# EasyEDA schematic SCH_teency_2021-08-24.json
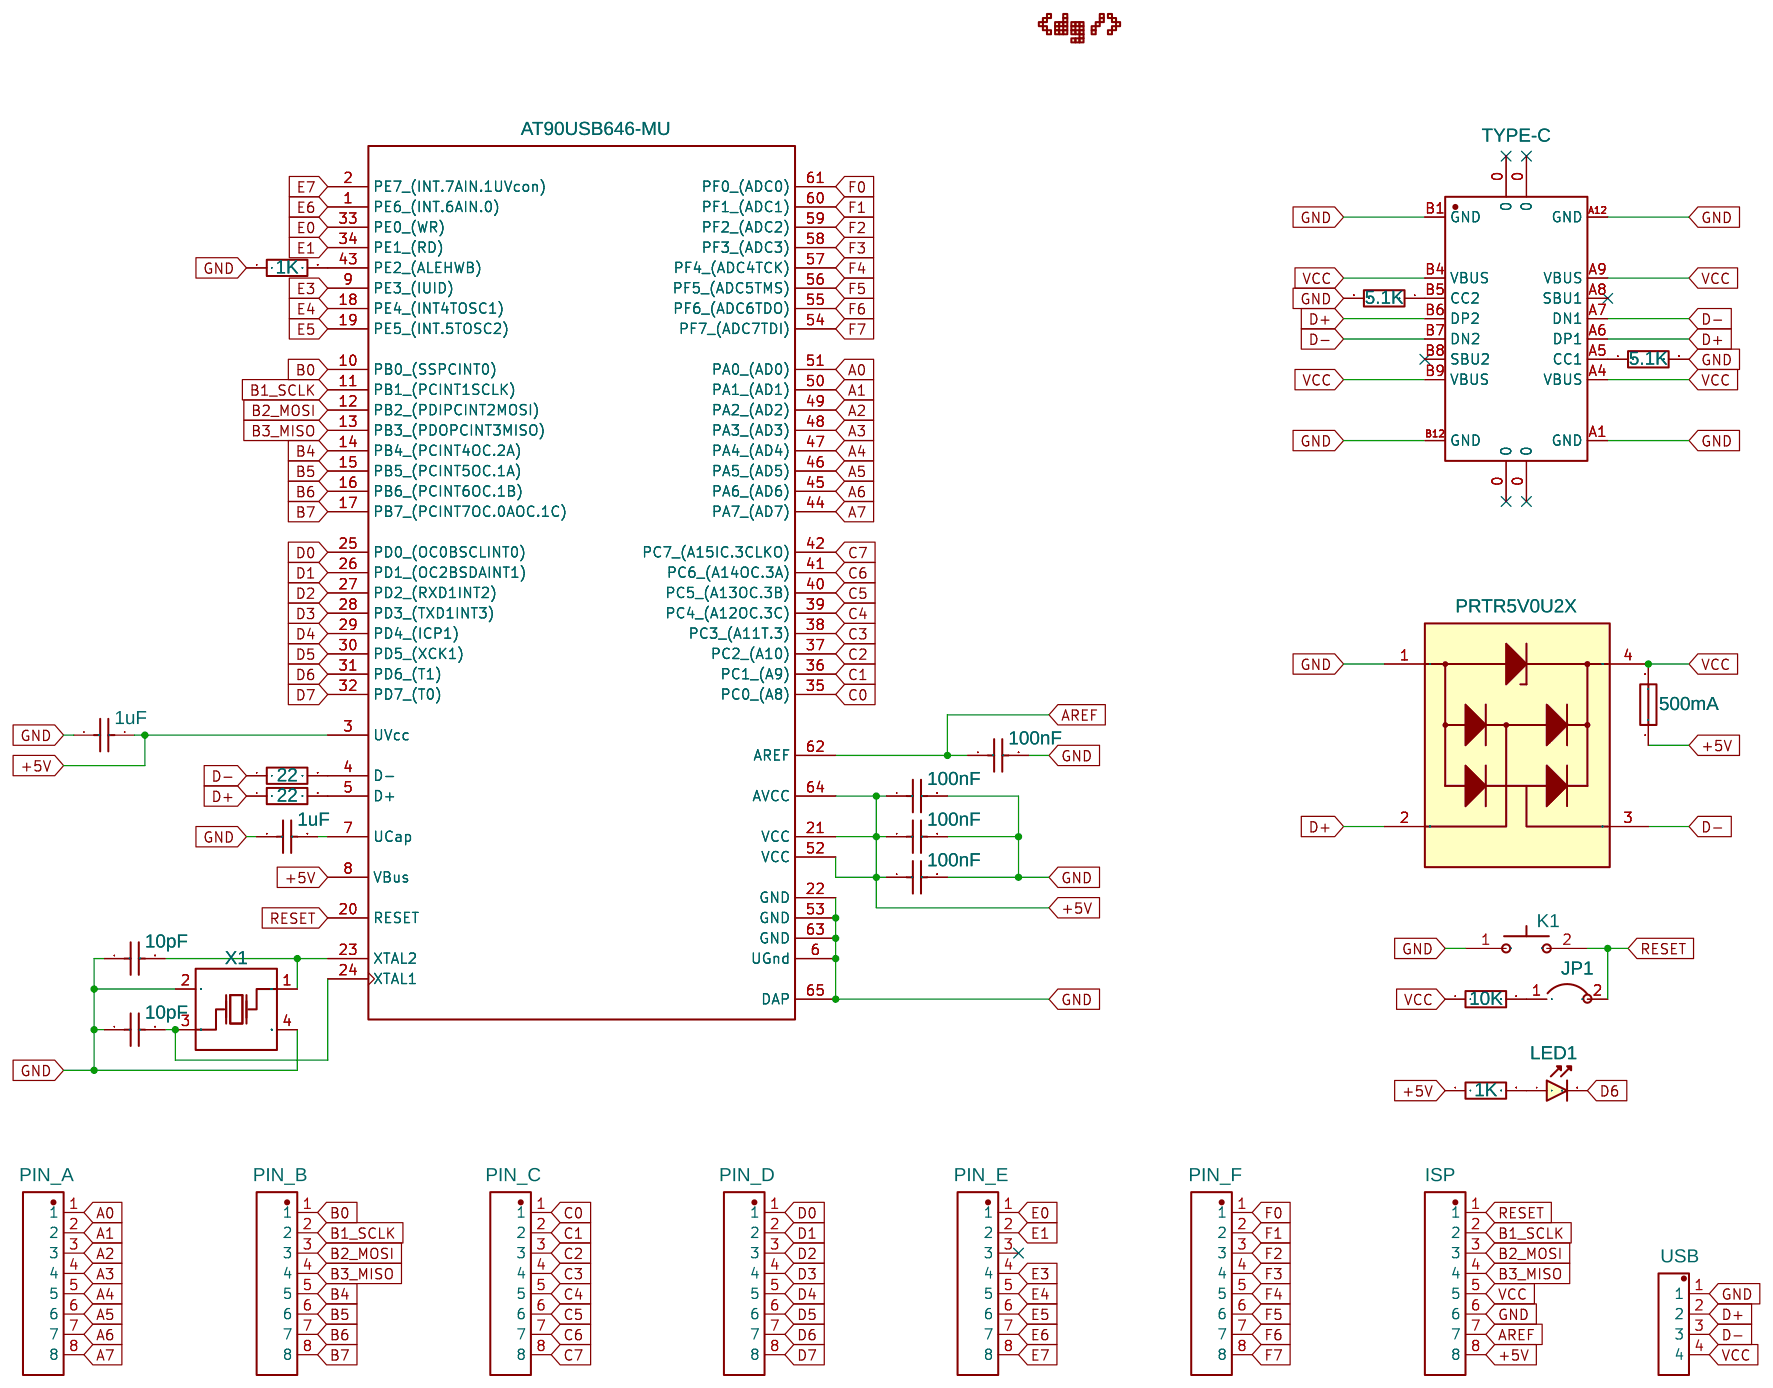
[diagram p0: schematic sheet]

## Parts
C1  1uF  [C0805]
C2  100nF  [C0805]
C3  100nF  [C0805]
C4  1uF  [C0805]
C5  100nF  [C0805]
C6  100nF  [C0805]
C7  10pF  [0805]
C8  10pF  [0805]
CN1  TYPE-C  [USB-C_SMD-TYPE-C-31-M-12]
F1  500mA  [F1206]
JP1  JUMPER  [JUMPER]
K1  3x6x2.5 Switch  [KEY-SMD_L6.1-W3.7-LS8.0]
L1  Logo  [LOGO_XL]
LED1  0603 LED  [0603 LED 0.8]
P1  PIN_A  [2.54 8P]
P2  PIN_B  [2.54 8P]
P3  PIN_C  [2.54 8P]
P4  PIN_D  [2.54 8P]
P5  PIN_E  [2.54 8P]
P6  PIN_F  [2.54 8P]
P7  ISP  [2.54 8P]
P8  USB  [LEE_2.54排针-P2.54-4P]
R1  1K  [R0805]
R2  5.1K  [R0805]
R3  5.1K  [R0805]
R4  22  [R0805]
R5  22  [R0805]
R6  10K  [R0805]
R7  1K  [R0805]
U1  AT90USB646-MU  [64PS]
U2  PRTR5V0U2X  [SOT-143_L2.9-W1.3-P1.92-LS2.3-BL]
X1  16MHz  [OSC-SMD_4P-L5.0-W3.2-BL]

## Library data of the parts
C1 C4 = CL21B105KBFNNNE: Supplier: LCSC; Manufacturer: SAMSUNG; LCSC Assembly: Yes; Supplier Part: C28323; SMT Type: Basic
C2 C3 C5 C6 = CC0805KRX7R9BB104: Supplier: LCSC; Manufacturer Part: CL21B104KBCNNNC; Manufacturer: SAMSUNG; LCSC Assembly: Yes; Supplier Part: C1711; SMT Type: Basic
C7 C8 = 贴片电容-0805-10pF: Supplier: LCSC; Manufacturer Part: CL21C100JBANNNC; Manufacturer: SAMSUNG; LCSC Assembly: Yes; Supplier Part: C1785; SMT Type: Basic
CN1 = TYPE-C-31-M-12: Supplier: LCSC; Supplier Part: C165948; Manufacturer: Rectangular Connectors - Contacts; Contributor: LCSC
F1 = MF-NSMF050-2: Supplier: LCSC; Manufacturer: BOURNS; Supplier Part: C75464; LCSC Assembly: Yes; SMT Type: Extend
JP1 = JUMPER: Contributor: dxgdsx
K1 = 1TS002E-2400-2500: Supplier: LCSC; Supplier Part: C319365; Manufacturer: HYP; Contributor: LCSC
L1 = Logo: Contributor: myst729
LED1 = 0603 LED: Contributor: Gerwin
P1-P7 = 2.54 8P: Contributor: danke16
P8 = Lee_2.54排针-P2.54-4P: Supplier: LCSC; Manufacturer: Ckmtw; Manufacturer Part: 210S-1*4P L=11.6MMGold-plated black; Contributor: EdwardLee2020; Supplier Part: C124378
R1 R7 = TC0525F1001T5E: Supplier: LCSC; Manufacturer: YAGEO; Manufacturer Part: RC0805JR-071KL; Supplier Part: C100046; LCSC Assembly: Yes; SMT Type: Extend
R2 R3 = 0805W8F5101T5E: Supplier: LCSC; Manufacturer: YAGEO; Manufacturer Part: RC0805JR-075K1L; LCSC Assembly: Yes; Supplier Part: C105874; SMT Type: Basic
R4 R5 = 0603WAF220JT5E: Supplier: LCSC; Manufacturer: YAGEO; Manufacturer Part: RC0805JR-0722RL; LCSC Assembly: Yes; Supplier Part: C108406; SMT Type: Basic
R6 = 0805W8F1002T5E: Supplier: LCSC; Manufacturer: YAGEO; Manufacturer Part: RC0805JR-0710KL; LCSC Assembly: Yes; Supplier Part: C100047; SMT Type: Basic
U1 = AT90USB646-MU: 8-bit AVR Microcontroller, 2.7-5.5V, 64KB Flash, 2KB EEPROM, 4KB SRAM, USB Controller, 64-pin VQFN, Industrial Grade (-40u7648 to 85u7648)
U2 = PRTR5V0U2X: Supplier: LCSC; Supplier Part: C330092; Manufacturer: Yenji Elec; Contributor: LCSC
X1 = X503216MSB4SI: Supplier: LCSC; Supplier Part: C112586; Manufacturer: Yangxing Tech; Contributor: LCSC; LCSC Assembly: Yes; SMT Type: Extend

## Nets
+5V: C1.2 C3.1 C5.1 C6.1 F1.1 P7.8 R7.1 U1.3(UVcc) U1.8(VBus) U1.21(VCC) U1.52(VCC) U1.64(AVCC)
GND: C1.1 C2.2 C3.2 C4.1 C5.2 C6.2 C7.1 C8.1 CN1.A1(GND) CN1.A12(GND) CN1.B1(GND) CN1.B12(GND) K1.1 P7.6 P8.1 R1.1 R2.2 R3.2 U1.6(UGnd) U1.22(GND) U1.53(GND) U1.63(GND) U1.65(DAP) U2.1(GND) X1.2(GND) X1.4(GND)
VCC: CN1.A4(VBUS) CN1.A9(VBUS) CN1.B4(VBUS) CN1.B9(VBUS) F1.2 P7.5 P8.4 R6.1 U2.4(VCC)
A0: P1.1 U1.51(PA0 (AD0))
A1: P1.2 U1.50(PA1 (AD1))
A2: P1.3 U1.49(PA2 (AD2))
A3: P1.4 U1.48(PA3 (AD3))
A4: P1.5 U1.47(PA4 (AD4))
A5: P1.6 U1.46(PA5 (AD5))
A6: P1.7 U1.45(PA6 (AD6))
A7: P1.8 U1.44(PA7 (AD7))
AREF: C2.1 P7.7 U1.62(AREF)
B0: P2.1 U1.10(PB0 (SSPCINT0))
B1_SCLK: P2.2 P7.2 U1.11(PB1 (PCINT1SCLK))
B2_MOSI: P2.3 P7.3 U1.12(PB2 (PDIPCINT2MOSI))
B3_MISO: P2.4 P7.4 U1.13(PB3 (PDOPCINT3MISO))
B4: P2.5 U1.14(PB4 (PCINT4OC.2A))
B5: P2.6 U1.15(PB5 (PCINT5OC.1A))
B6: P2.7 U1.16(PB6 (PCINT6OC.1B))
B7: P2.8 U1.17(PB7 (PCINT7OC.0AOC.1C))
C0: P3.1 U1.35(PC0 (A8))
C1: P3.2 U1.36(PC1 (A9))
C2: P3.3 U1.37(PC2 (A10))
C3: P3.4 U1.38(PC3 (A11T.3))
C4: P3.5 U1.39(PC4 (A12OC.3C))
C5: P3.6 U1.40(PC5 (A13OC.3B))
C6: P3.7 U1.41(PC6 (A14OC.3A))
C7: P3.8 U1.42(PC7 (A15IC.3CLKO))
D0: P4.1 U1.25(PD0 (OC0BSCLINT0))
D1: P4.2 U1.26(PD1 (OC2BSDAINT1))
D2: P4.3 U1.27(PD2 (RXD1INT2))
D3: P4.4 U1.28(PD3 (TXD1INT3))
D4: P4.5 U1.29(PD4 (ICP1))
D5: P4.6 U1.30(PD5 (XCK1))
D6: LED1.C P4.7 U1.31(PD6 (T1))
D7: P4.8 U1.32(PD7 (T0))
D+: CN1.A6(DP1) CN1.B6(DP2) P8.2 R5.1 U2.2(IO1)
D-: CN1.A7(DN1) CN1.B7(DN2) P8.3 R4.1 U2.3(IO2)
E0: P5.1 U1.33(PE0 (WR))
E1: P5.2 U1.34(PE1 (RD))
E3: P5.4 U1.9(PE3 (IUID))
E4: P5.5 U1.18(PE4 (INT4TOSC1))
E5: P5.6 U1.19(PE5 (INT.5TOSC2))
E6: P5.7 U1.1(PE6 (INT.6AIN.0))
E7: P5.8 U1.2(PE7 (INT.7AIN.1UVcon))
F0: P6.1 U1.61(PF0 (ADC0))
F1: P6.2 U1.60(PF1 (ADC1))
F2: P6.3 U1.59(PF2 (ADC2))
F3: P6.4 U1.58(PF3 (ADC3))
F4: P6.5 U1.57(PF4 (ADC4TCK))
F5: P6.6 U1.56(PF5 (ADC5TMS))
F6: P6.7 U1.55(PF6 (ADC6TDO))
F7: P6.8 U1.54(PF7 (ADC7TDI))
RESET: JP1.2 K1.2 P7.1 U1.20(RESET)
Net-(C4-2): C4.2 U1.7(UCap)
Net-(C7-2): C7.2 U1.23(XTAL2) X1.1(OSC1)
Net-(C8-2): C8.2 U1.24(XTAL1) X1.3(OSC2)
Net-(CN1-A5): CN1.A5(CC1) R3.1
Net-(CN1-B5): CN1.B5(CC2) R2.1
Net-(JP1-1): JP1.1 R6.2
Net-(LED1-A): LED1.A R7.2
Net-(R1-2): R1.2 U1.43(PE2 (ALEHWB))
Net-(R4-2): R4.2 U1.4(D-)
Net-(R5-2): R5.2 U1.5(D+)

Not connected (* = marked no-connect by the designer): CN1 0* A8(SBU1)* B8(SBU2)*; P5 3*
